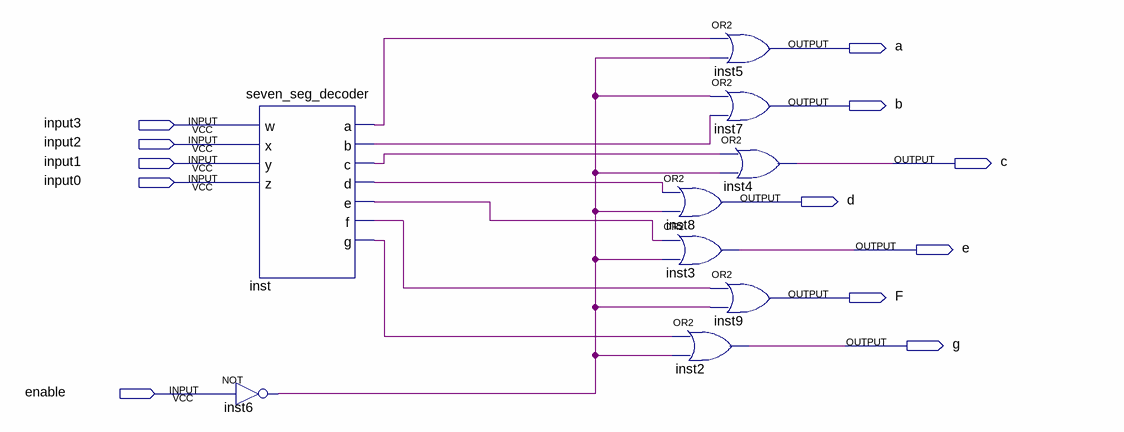
[diagram p0: schematic sheet]
// Quartus schematic sevenSegEnable.bdf as structural Verilog: 9 symbols, 12 pins
module sevenSegEnable (
  input  input3,
  input  input2,
  input  input1,
  input  input0,
  input  enable,
  output a,
  output b,
  output c,
  output d,
  output e,
  output F,
  output g
);

  wire inst6_out, inst_a, inst_b, inst_c, inst_d, inst_e, inst_f, inst_g;

  seven_seg_decoder inst (
    .w(input3), .x(input2), .y(input1), .z(input0), .a(inst_a), .b(inst_b), .c(inst_c), .d(inst_d),
    .e(inst_e), .f(inst_f), .g(inst_g));
  not inst6 (inst6_out, enable);
  or inst5 (a, inst_a, inst6_out);
  or inst7 (b, inst6_out, inst_b);
  or inst4 (c, inst_c, inst6_out);
  or inst8 (d, inst_d, inst6_out);
  or inst3 (e, inst_e, inst6_out);
  or inst9 (F, inst_f, inst6_out);
  or inst2 (g, inst_g, inst6_out);
endmodule
